# Altium schematic sheet SoC_DDR.SchDoc
size A4; SheetNumber: 18; SheetTotal: 22
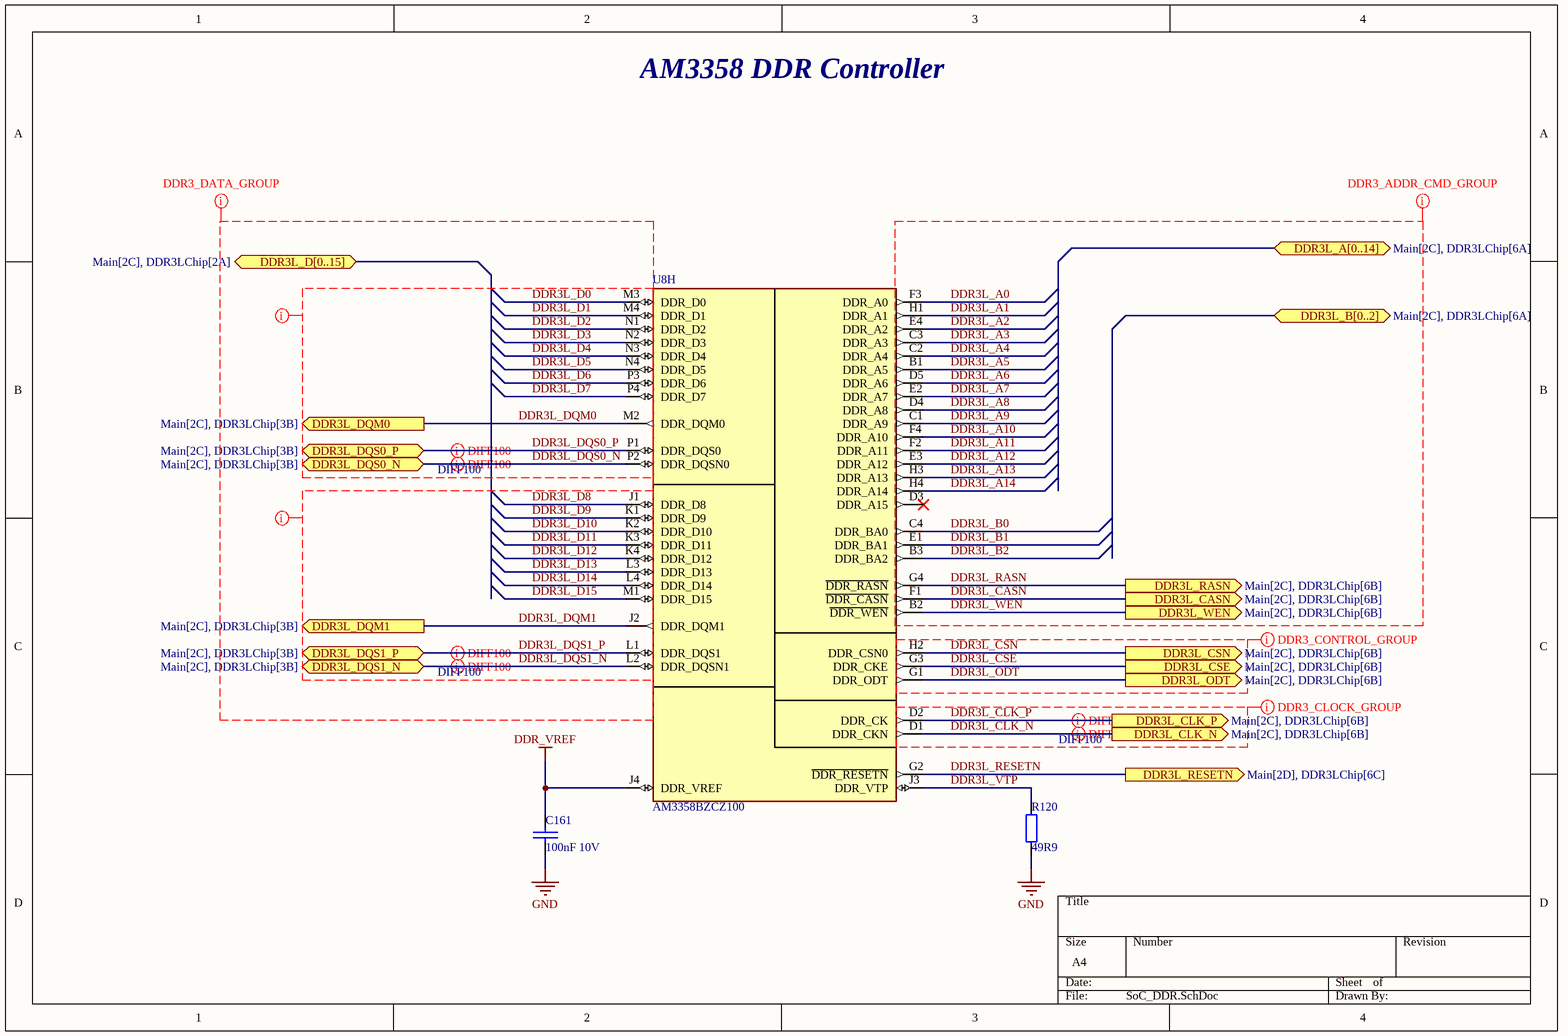
[diagram p0: SoC_DDR.SchDoc]

## Parts
C161  100nF 10V  [C_0201]
R120  49R9  [R_0402]
U8  AM3358BZCZ100  [BGA324C80P18X18_1500X1500X140]  (part H of 9)

## Ports
DDR3L_A[0..14] (bidir, see Main[2C], DDR3LChip[6A]), DDR3L_B[0..2] (bidir, see Main[2C], DDR3LChip[6A]), DDR3L_CASN (out, see Main[2C], DDR3LChip[6B]), DDR3L_CLK_N (out, see Main[2C], DDR3LChip[6B]), DDR3L_CLK_P (out, see Main[2C], DDR3LChip[6B]), DDR3L_CSE (out, see Main[2C], DDR3LChip[6B]), DDR3L_CSN (out, see Main[2C], DDR3LChip[6B]), DDR3L_D[0..15] (bidir, see Main[2C], DDR3LChip[2A]), DDR3L_DQM0 (out, see Main[2C], DDR3LChip[3B]), DDR3L_DQM1 (out, see Main[2C], DDR3LChip[3B]), DDR3L_DQS0_N (bidir, see Main[2C], DDR3LChip[3B]), DDR3L_DQS0_P (bidir, see Main[2C], DDR3LChip[3B]), DDR3L_DQS1_N (bidir, see Main[2C], DDR3LChip[3B]), DDR3L_DQS1_P (bidir, see Main[2C], DDR3LChip[3B]), DDR3L_ODT (out, see Main[2C], DDR3LChip[6B]), DDR3L_RASN (out, see Main[2C], DDR3LChip[6B]), DDR3L_RESETN (out, see Main[2D], DDR3LChip[6C]), DDR3L_WEN (out, see Main[2C], DDR3LChip[6B])

## Nets
DDR_VREF: C161.1 U8.J4(DDR_VREF)
GND: C161.2 R120.1
DDR3L_A0: U8.F3(DDR_A0)
DDR3L_A1: U8.H1(DDR_A1)
DDR3L_A2: U8.E4(DDR_A2)
DDR3L_A3: U8.C3(DDR_A3)
DDR3L_A4: U8.C2(DDR_A4)
DDR3L_A5: U8.B1(DDR_A5)
DDR3L_A6: U8.D5(DDR_A6)
DDR3L_A7: U8.E2(DDR_A7)
DDR3L_A8: U8.D4(DDR_A8)
DDR3L_A9: U8.C1(DDR_A9)
DDR3L_A10: U8.F4(DDR_A10)
DDR3L_A11: U8.F2(DDR_A11)
DDR3L_A12: U8.E3(DDR_A12)
DDR3L_A13: U8.H3(DDR_A13)
DDR3L_A14: U8.H4(DDR_A14)
DDR3L_B0: U8.C4(DDR_BA0)
DDR3L_B1: U8.E1(DDR_BA1)
DDR3L_B2: U8.B3(DDR_BA2)
DDR3L_CASN: U8.F1(~{DDR_CASN}) ; port DDR3L_CASN
DDR3L_CLK_N: U8.D1(DDR_CKN) ; port DDR3L_CLK_N
DDR3L_CLK_P: U8.D2(DDR_CK) ; port DDR3L_CLK_P
DDR3L_CSE: U8.G3(DDR_CKE) ; port DDR3L_CSE
DDR3L_CSN: U8.H2(DDR_CSN0) ; port DDR3L_CSN
DDR3L_D0: U8.M3(DDR_D0)
DDR3L_D1: U8.M4(DDR_D1)
DDR3L_D2: U8.N1(DDR_D2)
DDR3L_D3: U8.N2(DDR_D3)
DDR3L_D4: U8.N3(DDR_D4)
DDR3L_D5: U8.N4(DDR_D5)
DDR3L_D6: U8.P3(DDR_D6)
DDR3L_D7: U8.P4(DDR_D7)
DDR3L_D8: U8.J1(DDR_D8)
DDR3L_D9: U8.K1(DDR_D9)
DDR3L_D10: U8.K2(DDR_D10)
DDR3L_D11: U8.K3(DDR_D11)
DDR3L_D12: U8.K4(DDR_D12)
DDR3L_D13: U8.L3(DDR_D13)
DDR3L_D14: U8.L4(DDR_D14)
DDR3L_D15: U8.M1(DDR_D15)
DDR3L_DQM0: U8.M2(DDR_DQM0) ; port DDR3L_DQM0
DDR3L_DQM1: U8.J2(DDR_DQM1) ; port DDR3L_DQM1
DDR3L_DQS0_N: U8.P2(DDR_DQSN0) ; port DDR3L_DQS0_N
DDR3L_DQS0_P: U8.P1(DDR_DQS0) ; port DDR3L_DQS0_P
DDR3L_DQS1_N: U8.L2(DDR_DQSN1) ; port DDR3L_DQS1_N
DDR3L_DQS1_P: U8.L1(DDR_DQS1) ; port DDR3L_DQS1_P
DDR3L_ODT: U8.G1(DDR_ODT) ; port DDR3L_ODT
DDR3L_RASN: U8.G4(~{DDR_RASN}) ; port DDR3L_RASN
DDR3L_RESETN: U8.G2(~{DDR_RESETN}) ; port DDR3L_RESETN
DDR3L_VTP: R120.2 U8.J3(DDR_VTP)
DDR3L_WEN: U8.B2(~{DDR_WEN}) ; port DDR3L_WEN

Not connected (* = marked no-connect by the designer): U8 D3(DDR_A15)*

## Layout directives
differential pair; differential pair class DIFF100: DDR3L_CLK_N, DDR3L_CLK_P, DDR3L_DQS0_N, DDR3L_DQS0_P, DDR3L_DQS1_N, DDR3L_DQS1_P
net class DDR3_DATA_GROUP: DDR3L_D0, DDR3L_D1, DDR3L_D2, DDR3L_D3, DDR3L_D4, DDR3L_D5, DDR3L_D6, DDR3L_D7, DDR3L_D8, DDR3L_D9, DDR3L_D10, DDR3L_D11, DDR3L_D12, DDR3L_D13, DDR3L_D14, DDR3L_D15, DDR3L_DQM0, DDR3L_DQM1, DDR3L_DQS0_N, DDR3L_DQS0_P, DDR3L_DQS1_N, DDR3L_DQS1_P
net class DDR3_DATA_BYTE_GROUP_0: DDR3L_D0, DDR3L_D1, DDR3L_D2, DDR3L_D3, DDR3L_D4, DDR3L_D5, DDR3L_D6, DDR3L_D7, DDR3L_DQM0, DDR3L_DQS0_N, DDR3L_DQS0_P
net class DDR3_DATA_BYTE_GROUP_1: DDR3L_D8, DDR3L_D9, DDR3L_D10, DDR3L_D11, DDR3L_D12, DDR3L_D13, DDR3L_D14, DDR3L_D15, DDR3L_DQM1, DDR3L_DQS1_N, DDR3L_DQS1_P
net class DDR3_ADDR_CMD_GROUP: DDR3L_A0, DDR3L_A1, DDR3L_A2, DDR3L_A3, DDR3L_A4, DDR3L_A5, DDR3L_A6, DDR3L_A7, DDR3L_A8, DDR3L_A9, DDR3L_A10, DDR3L_A11, DDR3L_A12, DDR3L_A13, DDR3L_A14, DDR3L_B0, DDR3L_B1, DDR3L_B2, DDR3L_CASN, DDR3L_RASN, DDR3L_WEN
net class DDR3_CONTROL_GROUP: DDR3L_CSE, DDR3L_CSN, DDR3L_ODT
net class DDR3_CLOCK_GROUP: DDR3L_CLK_N, DDR3L_CLK_P

## Notes on the sheet
- AM3358 DDR Controller

## Library data of the parts
C161 = C_0201: Capacitor 0201 SMD
R120 = R_0402: Resistor 0402 SMD
U8 = AM3358BZCZ100: ARM-ASeries 1GHz NFBGA-324 Microcontrollers (MCU/MPU/SOC) ROHS; Manufacturer: Texas Instruments; Manufacturer Part Number: AM3358BZCZ100; Datasheet Link: https://www.ti.com/lit/ds/symlink/am3358.pdf